# EAGLE design v06 (EAGLE 5.09)
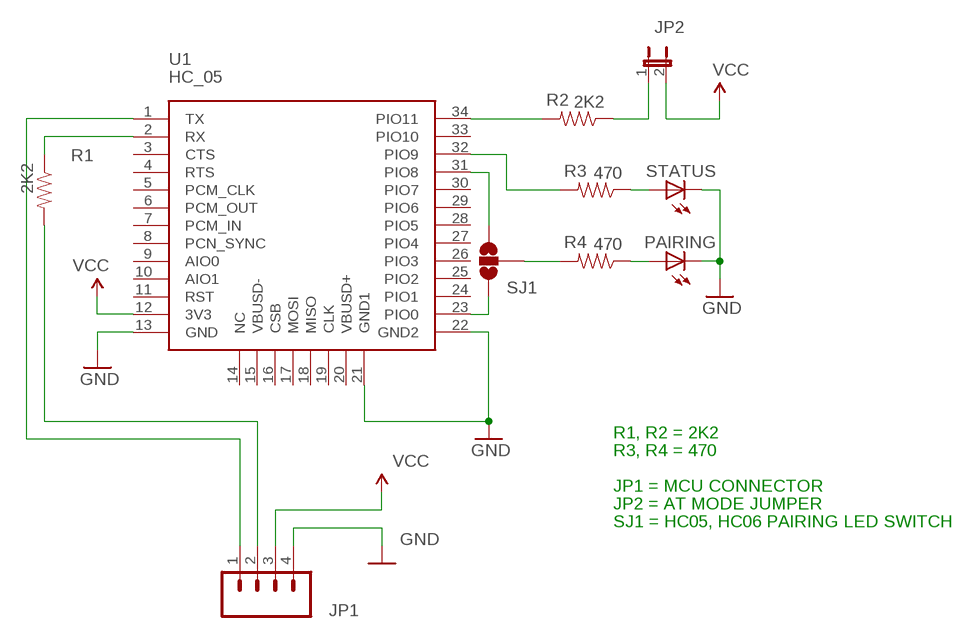
[diagram p0: schematic, sheet 1]

## Parts
JP1  M04LONGPADS  [1X04_LONGPADS]
JP2  JUMPER-2PTH  [1X02]
PAIRING  LED3MM  [LED3MM]
R1  2K2  RESISTORPTH-1/4W  [AXIAL-0.4]
R2  2K2  RESISTORPTH-1/4W  [AXIAL-0.4]
R3  470  RESISTORPTH-1/4W  [AXIAL-0.4]
R4  470  RESISTORPTH-1/4W  [AXIAL-0.4]
SJ1  SOLDERJUMPER_2WAYT  [SJ_2]
STATUS  LED3MM  [LED3MM]
U1  HC_05  [BLUETOOTH_SMD]

## Nets
GND: JP1.4 PAIRING.K(C) STATUS.K(C) U1.13(GND) U1.21(GND1) U1.22(GND2)
N$1: R1.P$1 U1.2(RX)
N$2: R2.P$2 U1.34(PIO11)
N$3: JP1.2 R1.P$2
N$4: JP1.1 U1.1(TX)
N$5: R3.P$2 U1.32(PIO9)
N$6: SJ1.3 U1.31(PIO8)
N$7: R3.P$1 STATUS.A
N$8: PAIRING.A R4.P$1
N$9: JP2.1 R2.P$1
N$10: R4.P$2 SJ1.2
N$11: SJ1.1 U1.23(PIO0)
VCC: JP1.3 JP2.2 U1.12(3V3)
Unconnected: U1.3(CTS) U1.4(RTS) U1.5(PCM_CLK) U1.6(PCM_OUT) U1.7(PCM_IN) U1.8(PCN_SYNC) U1.9(AIO0) U1.10(AIO1) U1.11(RST) U1.14(NC) U1.15(VBUSD-) U1.16(CSB) U1.17(MOSI) U1.18(MISO) U1.19(CLK) U1.20(VBUSD+) U1.24(PIO1) U1.25(PIO2) U1.26(PIO3) U1.27(PIO4) U1.28(PIO5) U1.29(PIO6) U1.30(PIO7) U1.33(PIO10)

## Notes on the sheet
- R1, R2 = 2K2
- R3, R4 = 470
- JP1 = MCU CONNECTOR
- JP2 = AT MODE JUMPER
- SJ1 = HC05, HC06 PAIRING LED SWITCH

## Library data of the parts
JP1 = SparkFun:M04: Header 4 Standard 4-pin 0.1" header. Use with straight break away headers (SKU : PRT-00116), right angle break away headers (PRT-00553), swiss pins (PRT-00743), machine pins (PRT-00117), and female headers (PRT-00115). Molex polarized connector foot print use with SKU : PRT-08231 with associated crimp pins and housings. 1MM SMD Version SKU: PRT-10208
JP2 = SparkFun:JUMPER-2: Jumper Basic 0.1" spaced jumper. Use with breakaway headers.
PAIRING STATUS = adafruit:LED: LED OSRAM: - CHIPLED LG R971, LG N971, LY N971, LG Q971, LY Q971, LO R971, LY R971 LH N974, LH R974 LS Q976, LO Q976, LY Q976 LO Q996 - Hyper CHIPLED LW Q18S LB Q993, LB Q99A, LB R99A - SideLED LS A670, LO A670, LY A670, LG A670, LP A670 LB A673, LV A673, LT A673, LW A673 LH A674 LY A675 LS A676, LA A676, LO A676, LY A676, LW A676 LS A679, LY A679, LG A679 - Hyper Micro SIDELED® LS Y876, LA Y876, LO Y876, LY Y876 LT Y87S - SmartLED LW L88C, LW L88S LB L89C, LB L89S, LG L890 LS L89K, LO L89K, LY L89K LS L896, LA L896, LO L896, LY L896 - TOPLED LS T670, LO T670, LY T670, LG T670, LP T670 LSG T670, LSP T670, LSY T670, LOP T670, LYG T670 LG T671, LOG T671, LSG T671 LB T673, LV T673, LT T673, LW T673 LH T674 LS T676, LA T676, LO T676, LY T676, LB T676, LH T676, LSB T676, LW T676 LB T67C, LV T67C, LT T67C, LS T67K, LO T67K, LY T67K, LW E67C LS E67B, LA E67B, LO E67B, LY E67B, LB E67C, LV E67C, LT E67C LW T67C LS T679, LY T679, LG T679 LS T770, LO T770, LY T770, LG T770, LP T770 LB T773, LV T773, LT T773, LW T773 LH T774 LS E675, LA E675, LY E675, LS T675 LS T776, LA T776, LO T776, LY T776, LB T776 LHGB T686 LT T68C, LB T68C - Hyper Mini TOPLED® LB M676 - Mini TOPLED Santana® LG M470 LS M47K, LO M47K, LY M47K Source: http://www.osram.convergy.de/
R1-R4 = SparkFun:RESISTOR: Resistor Basic schematic elements and footprints for 0603, 1206, and PTH resistors.
SJ1 = SparkFun:SOLDERJUMPER_2WAY: Solder Jumper 2 way solder jumper
U1 = SerialPortBluetooth:HC_05

## Board
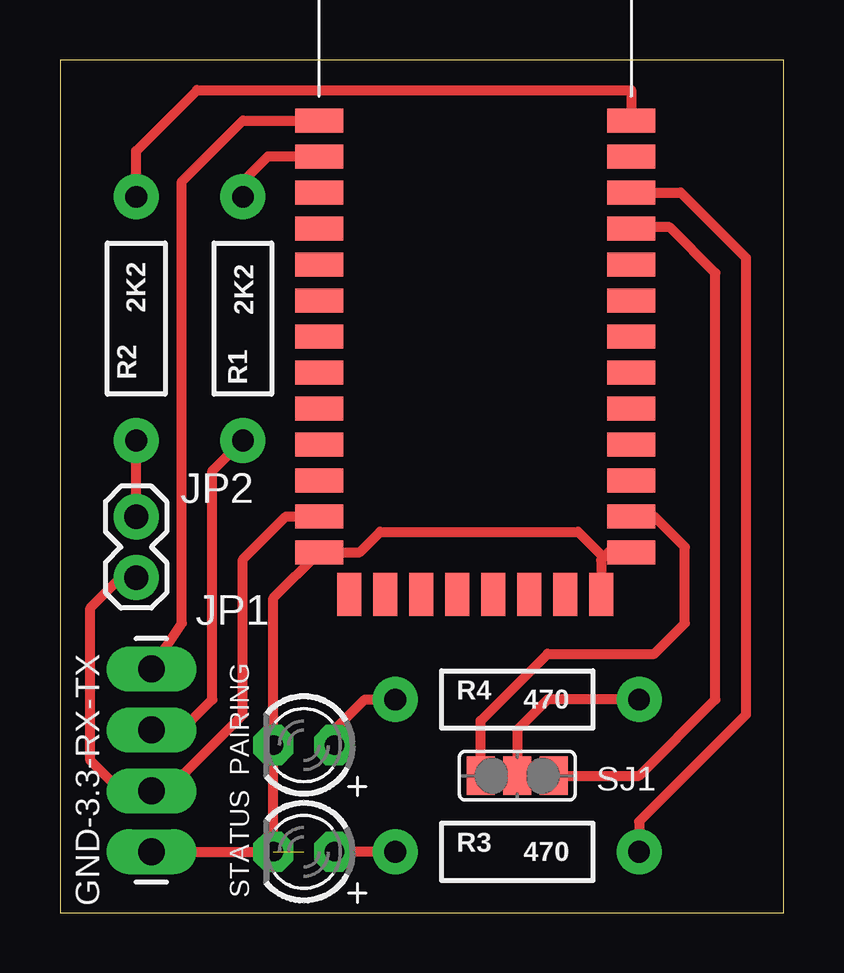
[diagram p1: board, top side]

Size 30.15 x 35.55 mm. Coordinates in mm from the lower left corner, seen from the top.
Outline: 0,0 30.15,0 30.15,35.55 0,35.55 0,0
Copper layers (1*16): Top 0.035mm / dielectric 1.5mm / Bottom 0.035mm
Design rules "default": minimum track width 10mil, minimum drill 24mil, track to track 8mil, track to pad 8mil, pad to pad 8mil, via to via 8mil, smd to smd 8mil, copper to edge 40mil, drill to drill 8mil, minimum pad ring 10mil, minimum via ring 8mil, stop-mask expansion 4mil, vias tented up to drill 0mil, thermal gap 10mil

### Footprints (pad centres in the part's own frame; a part is rotated, then mirrored left to right if it is on the bottom)
1X04_LONGPADS = drill 1.118 pad 1.88 long: 1 0,0; 2 2.54,0; 3 5.08,0; 4 7.62,0
1X02 = drill 1.016 pad 1.88 round: 1 0,0; 2 2.54,0
LED3MM = drill 0.813 pad 1.676 octagon: A -1.27,0; K 1.27,0
AXIAL-0.4 = drill 0.9 pad 1.88 round: P$1 -5.08,0; P$2 5.08,0
SJ_2 = smd 1.168 x 1.6: 1 -1.524,0; 2 0,0; 3 1.524,0
BLUETOOTH_SMD = smd 2 x 1: 1 0,0; 2 0,-1.5; 3 0,-3; 4 0,-4.5; 5 0,-6; 6 0,-7.5; 7 0,-9; 8 0,-10.5; 9 0,-12; 10 0,-13.5; 11 0,-15; 12 0,-16.5; 13 0,-18; 22 13,-18; 23 13,-16.5; 24 13,-15; 25 13,-13.5; 26 13,-12; 27 13,-10.5; 28 13,-9; 29 13,-7.5; 30 13,-6; 31 13,-4.5; 32 13,-3; 33 13,-1.5; 34 13,0 | smd 1 x 1.8: 14 1.25,-19.75; 15 2.75,-19.75; 16 4.25,-19.75; 17 5.75,-19.75; 18 7.25,-19.75; 19 8.75,-19.75; 20 10.25,-19.75; 21 11.75,-19.75

### Placement (x,y rotation side)
JP1  3.81,10.16 270 top
JP2  3.18,16.51 270 top
PAIRING  10.16,6.99 180 top
R1  7.62,24.77 270 top
R2  3.18,24.77 90 top
R3  19.05,2.54 0 top
R4  19.05,8.89 0 top
SJ1  19.05,5.71 0 top
STATUS  10.16,2.54 180 top
U1  10.79,33.02 0 top

### Tracks (layer width: path | path; a pad name or v marks a point on that pad's centre or on a via)
GND  (1 unrouted)
  Top 0.406: JP1.4 STATUS.K PAIRING.K 8.89,13.12 U1.13 12.48,15.02 13.34,15.88 21.59,15.88 22.65,14.81 | U1.22 22.86,15.02 22.65,14.81 | U1.21 22.55,14.71 22.65,14.81
N$1
  Top 0.406: U1.2 8.66,31.52 7.62,30.48 R1.P$1
N$2
  Top 0.406: R2.P$2 3.18,31.75 5.71,34.29 23.8,34.29 U1.34
N$3
  Top 0.406: JP1.2 5.08,7.62 6.35,8.89 6.35,18.41 R1.P$2
N$4
  Top 0.406: JP1.1 5.08,12.06 5.08,30.48 7.62,33.02 U1.1
N$5
  Top 0.406: U1.32 25.86,30.02 28.57,27.3 28.57,8.26 24.13,3.81 R3.P$2
N$6
  Top 0.406: SJ1.3 24.13,5.71 27.3,8.89 27.3,26.67 25.4,28.57 23.85,28.57 U1.31
N$7
  Top 0.406: R3.P$1 STATUS.A
N$8
  Top 0.406: PAIRING.A 11.43,7.62 12.7,8.89 R4.P$1
N$9
  Top 0.406: JP2.1 R2.P$1
N$10
  Top 0.406: R4.P$2 20.32,8.89 19.05,7.62 SJ1.2
N$11
  Top 0.406: SJ1.1 17.53,8 20.32,10.79 24.77,10.79 26.04,12.06 26.04,15.24 24.77,16.51 23.8,16.51 U1.23
VCC
  Top 0.406: JP2.2 2.54,13.97 1.27,12.7 1.27,6.35 2.54,5.08 JP1.3 4.45,5.08 7.62,8.26 7.62,14.72 9.41,16.52 10.8,16.52 U1.12

### Text on the board
tNames: GND-3.3-RX-TX
bNames: 2012 | v06 | CC BY-SA | Pictu[X]uni | GND-3.3-RX-TX
bValues: BT Breakout